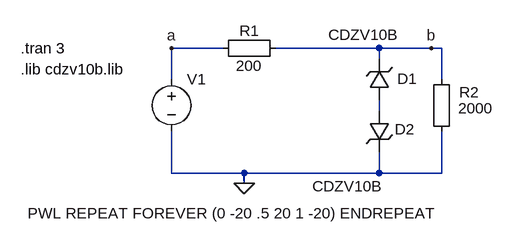
[diagram p0: schematic PL-B2.asc]
PL-B2.asc, the LTspice schematic file:
Version 4
SHEET 1 880 680
WIRE 16 112 -64 112
WIRE 256 112 96 112
WIRE 336 112 256 112
WIRE 352 112 336 112
WIRE 256 128 256 112
WIRE -64 160 -64 112
WIRE 352 160 352 112
WIRE 256 208 256 192
WIRE -64 304 -64 240
WIRE 48 304 -64 304
WIRE 256 304 256 272
WIRE 256 304 48 304
WIRE 352 304 352 240
WIRE 352 304 256 304
WIRE 48 320 48 304
FLAG -64 112 a
FLAG 336 112 b
FLAG 48 320 0
SYMBOL Misc\\EuropeanResistor 112 96 R90
WINDOW 0 5 56 VBottom 2
WINDOW 3 27 56 VTop 2
SYMATTR InstName R1
SYMATTR Value 200
SYMBOL zener 272 192 R180
WINDOW 0 -43 33 Left 2
WINDOW 3 -14 101 Left 2
SYMATTR InstName D1
SYMATTR Value CDZV10B
SYMATTR Description Diode
SYMATTR Type diode
SYMBOL Misc\\EuropeanResistor 368 256 R180
WINDOW 0 -42 76 Left 2
WINDOW 3 -64 52 Left 2
SYMATTR InstName R2
SYMATTR Value 2000
SYMBOL voltage -64 144 R0
WINDOW 3 -221 222 Left 2
WINDOW 123 0 0 Left 2
WINDOW 39 0 0 Left 2
SYMATTR Value PWL REPEAT FOREVER (0 -20 .5 20 1 -20) ENDREPEAT
SYMATTR InstName V1
SYMBOL zener 240 208 R0
WINDOW 0 40 29 Left 2
WINDOW 3 -87 116 Left 2
SYMATTR InstName D2
SYMATTR Value CDZV10B
SYMATTR Description Diode
SYMATTR Type diode
TEXT -296 112 Left 2 !.tran 3
TEXT -296 144 Left 2 !.lib cdzv10b.lib

The netlist it stands for:
* PL-B2.asc
R1 b a 200
D1 N001 b CDZV10B
R2 0 b 2000
V1 a 0 PWL REPEAT FOREVER (0 -20 .5 20 1 -20) ENDREPEAT
D2 N001 0 CDZV10B
.model D D
.lib standard.dio
.tran 3
.lib cdzv10b.lib
.backanno
.end